# EAGLE design Graduation_Project (EAGLE 9.6.2)
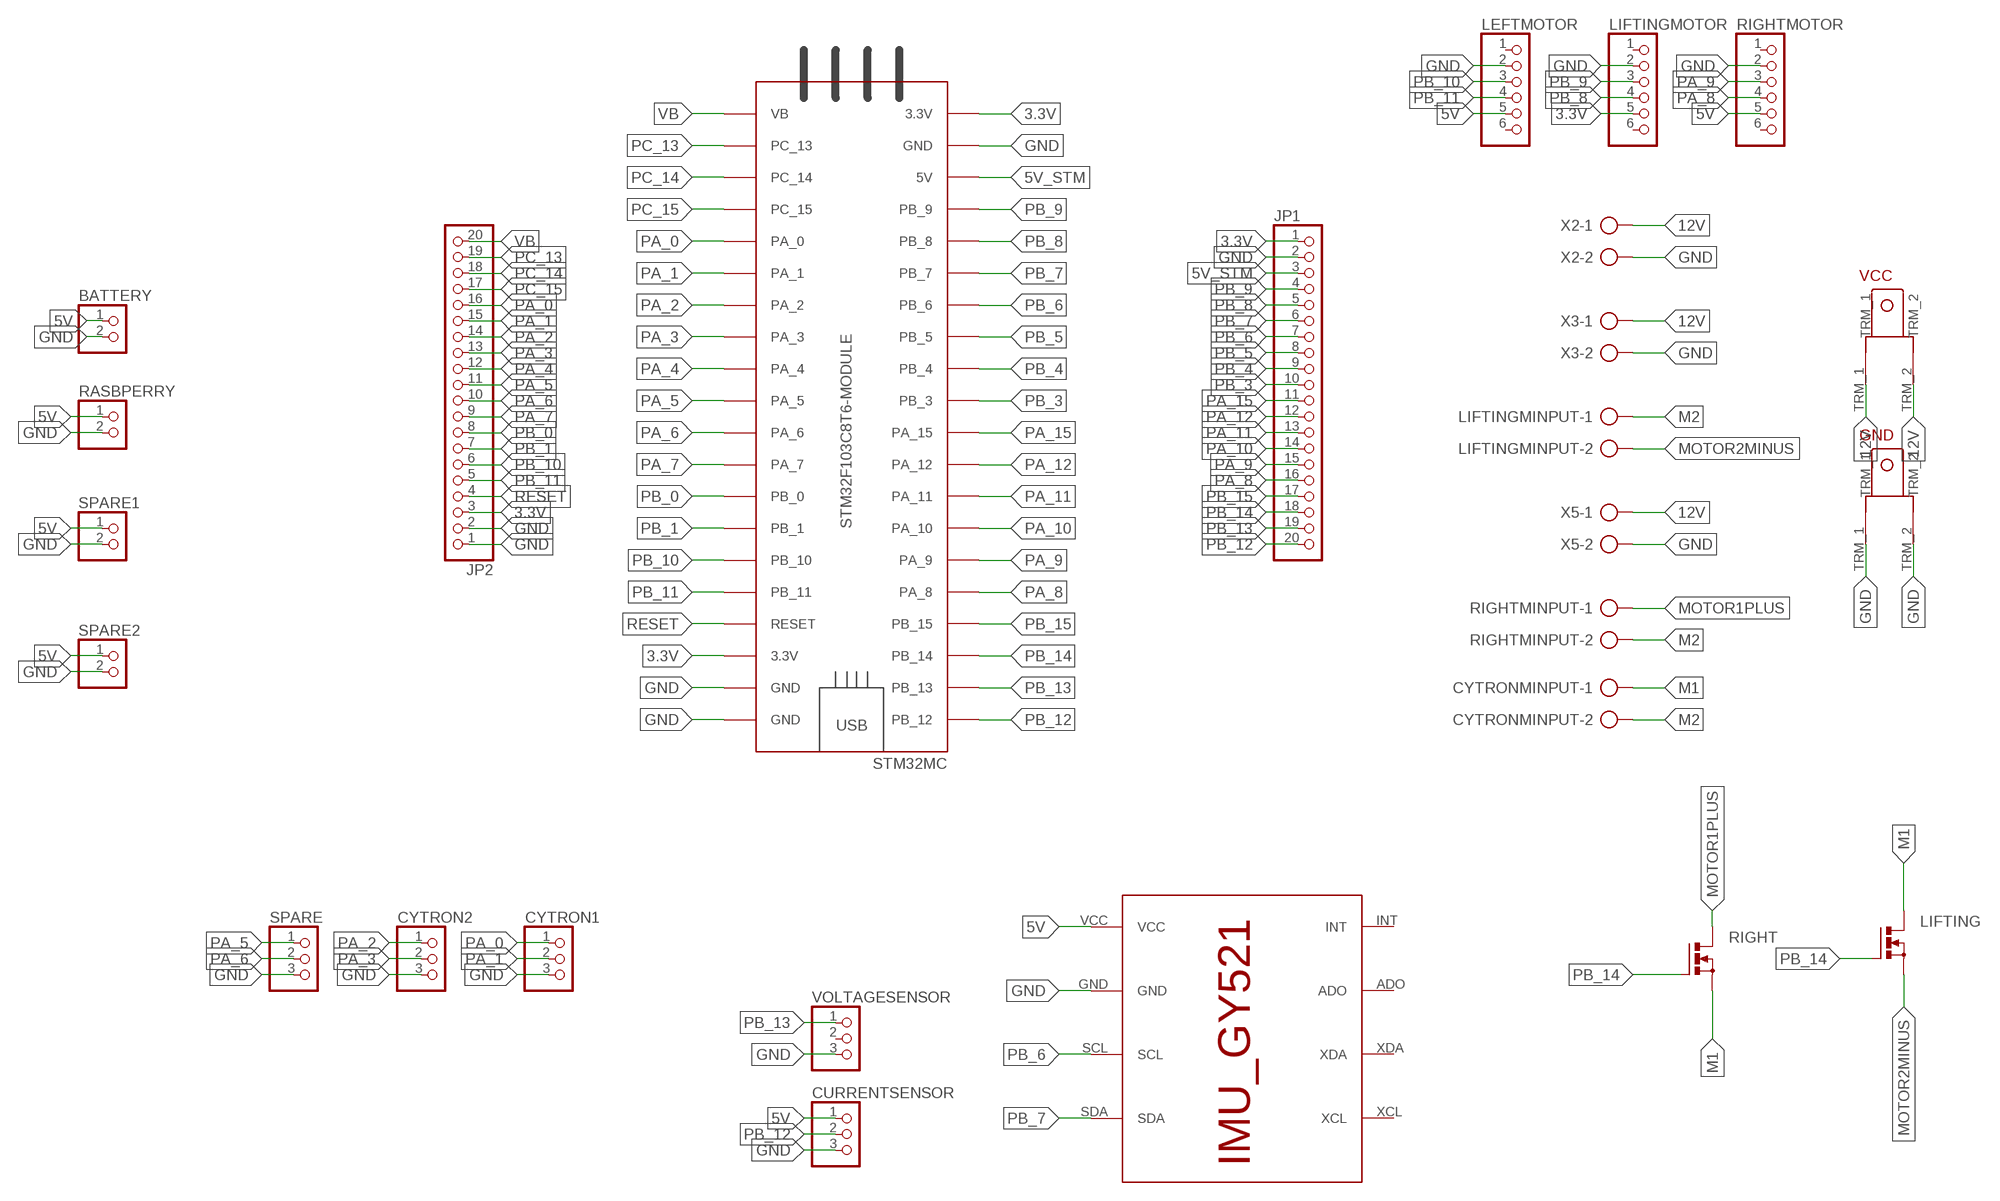
[diagram p0: schematic, sheet 1]

## Parts
BATTERY  PINHD-1X2  [1X02]
CURRENTSENSOR  PINHD-1X3  [1X03]
CYTRON1  PINHD-1X3  [1X03]
CYTRON2  PINHD-1X3  [1X03]
CYTRONMINPUT  AK300/2  [AK300/2]
GND  TERMINAL_EDITED  [TERMINAL_EDITED]
JP1  PINHD-1X20  [1X20]
JP2  PINHD-1X20  [1X20]
LEFTMOTOR  PINHD-1X6  [1X06]
LIFTING  MOSFET_NTO220BH  [TO220BH]
LIFTINGMINPUT  AK300/2  [AK300/2]
LIFTINGMOTOR  PINHD-1X6  [1X06]
RASBPERRY  PINHD-1X2  [1X02]
RIGHT  MOSFET_NTO220BH  [TO220BH]
RIGHTMINPUT  AK300/2  [AK300/2]
RIGHTMOTOR  PINHD-1X6  [1X06]
SPARE  PINHD-1X3  [1X03]
SPARE1  PINHD-1X2  [1X02]
SPARE2  PINHD-1X2  [1X02]
STM32MC  STM32F103C8T6-MODULE  [STM32F103C8T6-MODULE]
U$1  IMU_ROBOCON_GY521  [IMU_GY521]
VCC  TERMINAL_EDITED  [TERMINAL_EDITED]
VOLTAGESENSOR  PINHD-1X3  [1X03]
X2  AK300/2  [AK300/2]
X3  AK300/2  [AK300/2]
X5  AK300/2  [AK300/2]

## Nets
3.3V: JP1.1 JP2.3 LIFTINGMOTOR.5 STM32MC.3.3V_1(3.3V) STM32MC.3.3V_2(3.3V)
5V: BATTERY.1 CURRENTSENSOR.1 LEFTMOTOR.5 RASBPERRY.1 RIGHTMOTOR.5 SPARE1.1 SPARE2.1 U$1.VCC
5V_STM: JP1.3 STM32MC.5V
12V: VCC.TRM_1 VCC.TRM_2 X2.1 X3.1 X5.1
GND: BATTERY.2 CURRENTSENSOR.3 CYTRON1.3 CYTRON2.3 GND.TRM_1 GND.TRM_2 JP1.2 JP2.1 JP2.2 LEFTMOTOR.2 LIFTINGMOTOR.2 RASBPERRY.2 RIGHTMOTOR.2 SPARE1.2 SPARE2.2 SPARE.3 STM32MC.GND_1(GND) STM32MC.GND_2(GND) STM32MC.GND_3(GND) U$1.GND VOLTAGESENSOR.3 X2.2 X3.2 X5.2
M1: CYTRONMINPUT.1 LIFTING.D RIGHT.S
M2: CYTRONMINPUT.2 LIFTINGMINPUT.1 RIGHTMINPUT.2
MOTOR1PLUS: RIGHT.D RIGHTMINPUT.1
MOTOR2MINUS: LIFTING.S LIFTINGMINPUT.2
PA_0: CYTRON1.1 JP2.16 STM32MC.PA_0
PA_1: CYTRON1.2 JP2.15 STM32MC.PA_1
PA_2: CYTRON2.1 JP2.14 STM32MC.PA_2
PA_3: CYTRON2.2 JP2.13 STM32MC.PA_3
PA_4: JP2.12 STM32MC.PA_4
PA_5: JP2.11 SPARE.1 STM32MC.PA_5
PA_6: JP2.10 SPARE.2 STM32MC.PA_6
PA_7: JP2.9 STM32MC.PA_7
PA_8: JP1.16 RIGHTMOTOR.4 STM32MC.PA_8
PA_9: JP1.15 RIGHTMOTOR.3 STM32MC.PA_9
PA_10: JP1.14 STM32MC.PA_10
PA_11: JP1.13 STM32MC.PA_11
PA_12: JP1.12 STM32MC.PA_12
PA_15: JP1.11 STM32MC.PA_15
PB_0: JP2.8 STM32MC.PB_0
PB_1: JP2.7 STM32MC.PB_1
PB_3: JP1.10 STM32MC.PB_3
PB_4: JP1.9 STM32MC.PB_4
PB_5: JP1.8 STM32MC.PB_5
PB_6: JP1.7 STM32MC.PB_6 U$1.SCL
PB_7: JP1.6 STM32MC.PB_7 U$1.SDA
PB_8: JP1.5 LIFTINGMOTOR.4 STM32MC.PB_8
PB_9: JP1.4 LIFTINGMOTOR.3 STM32MC.PB_9
PB_10: JP2.6 LEFTMOTOR.3 STM32MC.PB_10
PB_11: JP2.5 LEFTMOTOR.4 STM32MC.PB_11
PB_12: CURRENTSENSOR.2 JP1.20 STM32MC.PB_12
PB_13: JP1.19 STM32MC.PB_13 VOLTAGESENSOR.1
PB_14: JP1.18 LIFTING.G RIGHT.G STM32MC.PB_14
PB_15: JP1.17 STM32MC.PB_15
PC_13: JP2.19 STM32MC.PC_13
PC_14: JP2.18 STM32MC.PC_14
PC_15: JP2.17 STM32MC.PC_15
RESET: JP2.4 STM32MC.RESET
VB: JP2.20 STM32MC.VB
Unconnected: LEFTMOTOR.1 LEFTMOTOR.6 LIFTINGMOTOR.1 LIFTINGMOTOR.6 RIGHTMOTOR.1 RIGHTMOTOR.6 U$1.ADO U$1.INT U$1.XCL U$1.XDA VOLTAGESENSOR.2

## Library data of the parts
BATTERY RASBPERRY SPARE1 SPARE2 = MIA-Training:PINHD-1X2: PIN HEADER
CURRENTSENSOR CYTRON1 CYTRON2 SPARE VOLTAGESENSOR = MIA-Training:PINHD-1X3: PIN HEADER
CYTRONMINPUT LIFTINGMINPUT RIGHTMINPUT X2 X3 X5 = con-ptr500:AK300/2: CONNECTOR; OC_FARNELL: unknown; OC_NEWARK: unknown
GND VCC = MIA_LIBRARY-2-2-2:TERMINAL_EDITED
JP1 JP2 = MIA_LIBRARY-2-2-2:PINHD-1X20: PIN HEADER
LEFTMOTOR LIFTINGMOTOR RIGHTMOTOR = MIA_LIBRARY-2-2-2:PINHD-1X6: PIN HEADER
LIFTING RIGHT = MIA_LIBRARY-2-2-2:MOSFET_N: Power MOSFET N-Channel
STM32MC = MIA_LIBRARY-2-2-2:STM32F103C8T6-MODULE: STM32F103C8T6 module with ARM Cortex-3, 20kB SRAM, 64kB Flash, 72MHz
U$1 = MIA_LIBRARY-2-2-2:IMU_ROBOCON_GY521

## Board
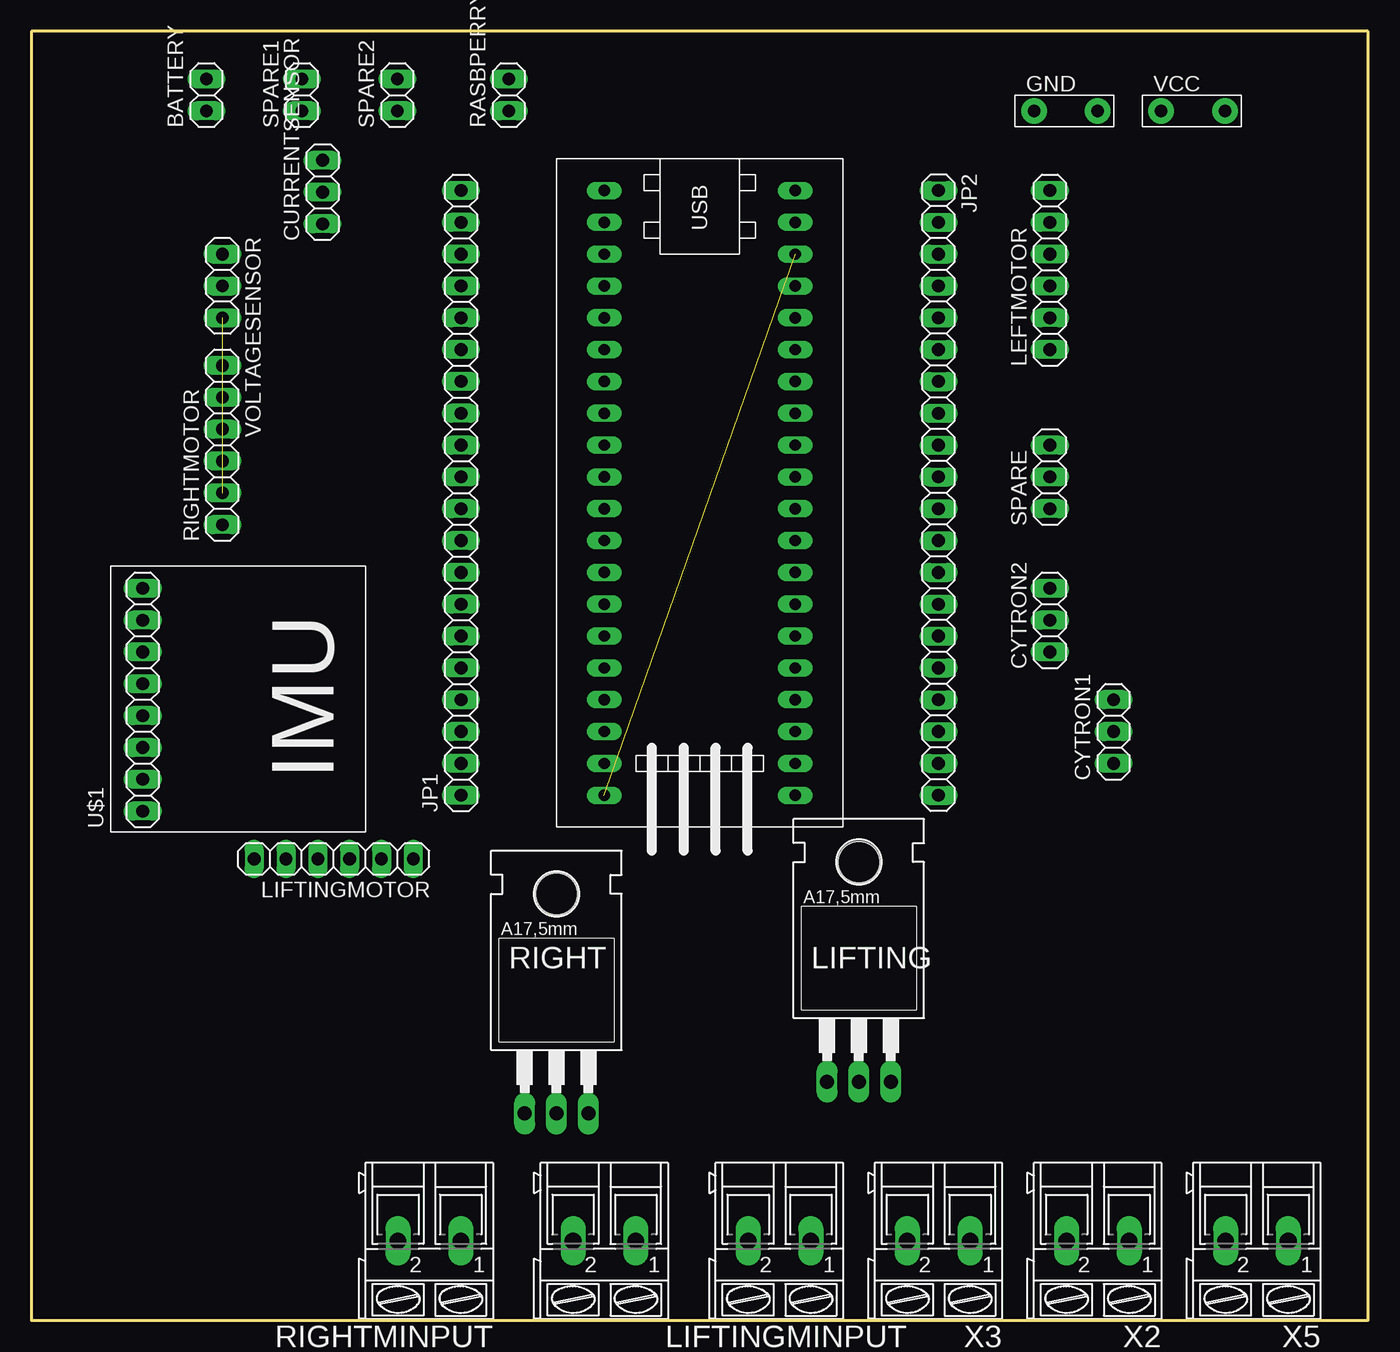
[diagram p1: board, top side]
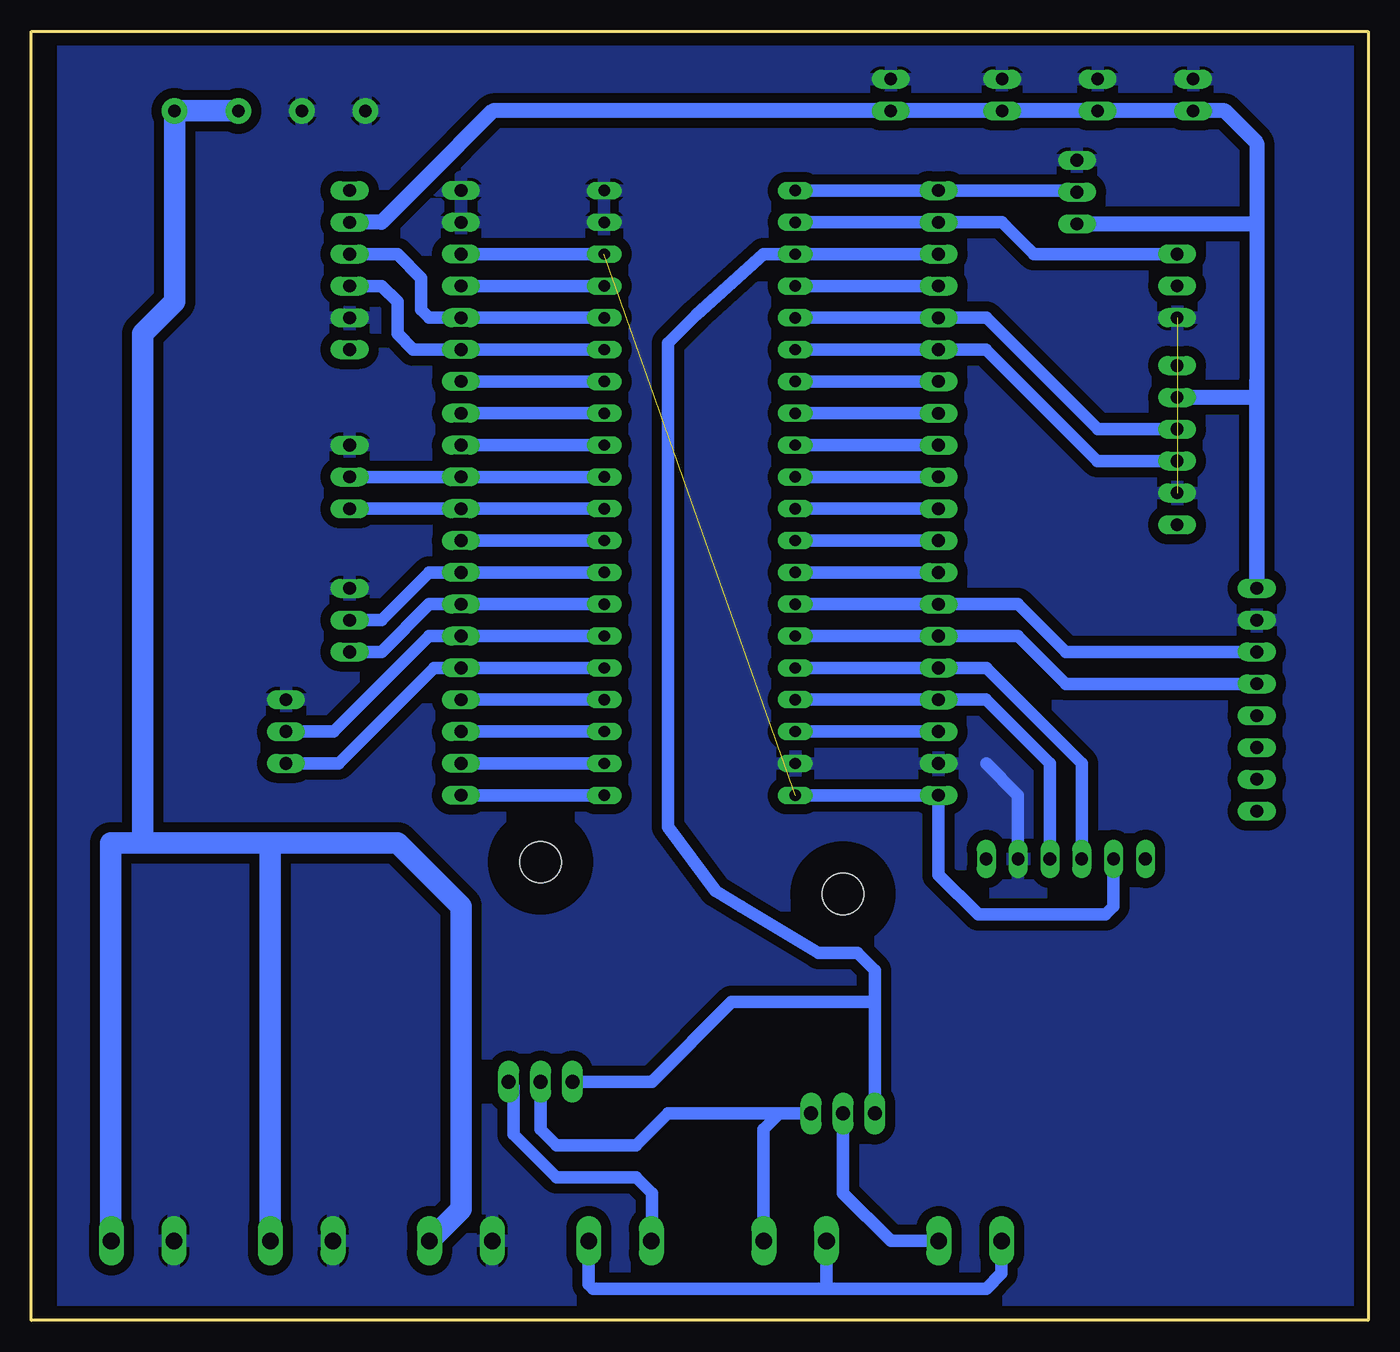
[diagram p2: board, bottom side, seen from below]

Size 106.68 x 102.87 mm. Coordinates in mm from the lower left corner, seen from the top.
Outline: 0,0 106.68,0 106.68,102.87 0,102.87 0,0
Copper layers (1*16): Top 0.035mm / dielectric 1.5mm / Bottom 0.035mm
Design rules "default *": minimum track width 0.8mm, minimum drill 0.35mm, track to track 0.8mm, track to pad 0.8mm, pad to pad 0.8mm, via to via 0.8mm, smd to smd 0.8mm, copper to edge 40mil, drill to drill 6mil, minimum pad ring 10mil, minimum via ring 8mil, stop-mask expansion 4mil, vias tented up to drill 0mil, thermal gap 10mil

### Footprints (pad centres in the part's own frame; a part is rotated, then mirrored left to right if it is on the bottom)
1X02 = drill 1.016 long: 1 -1.27,0; 2 1.27,0
1X03 = drill 1.016 long: 1 -2.54,0; 2 0,0; 3 2.54,0
AK300/2 = drill 1.321 long: 1 -2.515,0; 2 2.489,0
TERMINAL_EDITED = drill 1 pad 2.032: TRM_1 -2.54,0; TRM_2 2.54,0
1X20 = drill 1.016 long: 1 -24.13,0; 2 -21.59,0; 3 -19.05,0; 4 -16.51,0; 5 -13.97,0; 6 -11.43,0; 7 -8.89,0; 8 -6.35,0; 9 -3.81,0; 10 -1.27,0; 11 1.27,0; 12 3.81,0; 13 6.35,0; 14 8.89,0; 15 11.43,0; 16 13.97,0; 17 16.51,0; 18 19.05,0; 19 21.59,0; 20 24.13,0
1X06 = drill 1.016 long: 1 -6.35,0; 2 -3.81,0; 3 -1.27,0; 4 1.27,0; 5 3.81,0; 6 6.35,0
TO220BH = drill 1.118 long: D 0,-6.35; G -2.54,-6.35; S 2.54,-6.35 | hole 3.302: 0,11.176
STM32F103C8T6-MODULE = drill 0.9 long: 3.3V_1 25.4,-7.62; 3.3V_2 -17.78,7.62; 5V 20.32,-7.62; GND_1 22.86,-7.62; GND_2 -20.32,7.62; GND_3 -22.86,7.62; PA_0 15.24,7.62; PA_1 12.7,7.62; PA_2 10.16,7.62; PA_3 7.62,7.62; PA_4 5.08,7.62; PA_5 2.54,7.62; PA_6 0,7.62; PA_7 -2.54,7.62; PA_8 -12.7,-7.62; PA_9 -10.16,-7.62; PA_10 -7.62,-7.62; PA_11 -5.08,-7.62; PA_12 -2.54,-7.62; PA_15 0,-7.62; PB_0 -5.08,7.62; PB_1 -7.62,7.62; PB_3 2.54,-7.62; PB_4 5.08,-7.62; PB_5 7.62,-7.62; PB_6 10.16,-7.62; PB_7 12.7,-7.62; PB_8 15.24,-7.62; PB_9 17.78,-7.62; PB_10 -10.16,7.62; PB_11 -12.7,7.62; PB_12 -22.86,-7.62; PB_13 -20.32,-7.62; PB_14 -17.78,-7.62; PB_15 -15.24,-7.62; PC_13 22.86,7.62; PC_14 20.32,7.62; PC_15 17.78,7.62; RESET -15.24,7.62; VB 25.4,7.62
IMU_GY521 = drill 1.016 long: ADO -6.35,0; GND 6.35,0; INT -8.89,0; SCL 3.81,0; SDA 1.27,0; VCC 8.89,0; XCL -3.81,0; XDA -1.27,0

### Placement (x,y rotation side)
BATTERY  13.97,97.79 90 top
CURRENTSENSOR  23.24,90.04 90 top
CYTRON1  86.36,46.99 90 top
CYTRON2  81.28,55.88 90 top
CYTRONMINPUT  45.72,6.35 180 top
GND  82.55,96.52 0 top
JP1  34.29,66.04 90 top
JP2  72.39,66.04 270 top
LEFTMOTOR  81.28,83.82 90 top
LIFTING  66.04,25.4 0 top
LIFTINGMINPUT  59.69,6.35 180 top
LIFTINGMOTOR  24.13,36.83 180 top
RASBPERRY  38.1,97.79 90 top
RIGHT  41.91,22.86 0 top
RIGHTMINPUT  31.75,6.35 180 top
RIGHTMOTOR  15.24,69.85 90 top
SPARE  81.28,67.31 90 top
SPARE1  21.59,97.79 90 top
SPARE2  29.21,97.79 90 top
STM32MC  53.34,67.31 270 top
U$1  8.89,49.53 90 top
VCC  92.71,96.52 0 top
VOLTAGESENSOR  15.24,82.55 270 top
X2  85.09,6.35 180 top
X3  72.39,6.35 180 top
X5  97.79,6.35 180 top

### Tracks (layer width: path | path; a pad name or v marks a point on that pad's centre or on a via)
3.3V  (1 unrouted)
  Bottom 1: STM32MC.3.3V_1 JP1.1 34.29,35.56 31.11,32.38 20.95,32.38 20.32,33.02 LIFTINGMOTOR.5 | JP2.3 STM32MC.3.3V_2
5V
  Bottom 1.2: LEFTMOTOR.5 78.74,87.63 75.31,91.06 75.31,91.07 69.86,96.52 RASBPERRY.1 SPARE2.1 SPARE1.1 BATTERY.1 11.43,96.52 8.89,93.98 8.89,87.63 | 8.89,87.63 8.89,74.93 8.89,73.66 RIGHTMOTOR.5 | CURRENTSENSOR.1 9.02,87.5 8.89,87.63
  Bottom 1.22: U$1.VCC 8.89,74.93
5V_STM
  Bottom 1: JP1.3 STM32MC.5V
12V
  Bottom 1.7: 97.79,38.1 97.79,78.74 95.25,81.28 VCC.TRM_2 VCC.TRM_1 | X3.1 72.39,8.87 72.39,33.02 77.47,38.1 87.63,38.1 | 87.63,38.1 97.79,38.1 | 97.79,38.1 100.33,38.1 100.33,6.35 X5.1 | 87.63,38.1 87.61,38.08 X2.1
GND  (1 unrouted)
  Bottom 1: LIFTINGMOTOR.2 27.94,41.91 30.48,44.45
  pour Bottom: 1.27,101.6 104.14,101.6 104.14,1.27 1.27,1.27
M1
  Bottom 1: CYTRONMINPUT.1 48.26,6.38 48.26,15.24 46.99,16.51 RIGHT.S 55.88,16.51 58.42,13.97 64.77,13.97 66.04,15.24 LIFTING.D
M2
  Bottom 1: RIGHTMINPUT.2 29.26,3.76 30.48,2.54 43.23,2.54 | 43.23,2.54 CYTRONMINPUT.2 | LIFTINGMINPUT.1 62.2,2.89 61.86,2.54 43.23,2.54
MOTOR1PLUS
  Bottom 1: RIGHT.D 41.91,10.16 38.1,6.35 RIGHTMINPUT.1
MOTOR2MINUS
  Bottom 1: LIFTING.S 68.18,18.65 68.18,14.83 64.78,11.43 58.42,11.43 57.15,10.16 57.15,6.35 LIFTINGMINPUT.2
PA_0
  Bottom 1: STM32MC.PA_0 JP2.16 74.55,52.07 82.17,44.45 CYTRON1.1
PA_1
  Bottom 1: STM32MC.PA_1 JP2.15 74.92,54.61 82.54,46.99 CYTRON1.2
PA_2
  Bottom 1: STM32MC.PA_2 JP2.14 74.92,57.15 78.73,53.34 CYTRON2.1
PA_3
  Bottom 1: STM32MC.PA_3 JP2.13 74.93,59.69 78.74,55.88 CYTRON2.2
PA_4
  Bottom 1: JP2.12 STM32MC.PA_4
PA_5
  Bottom 1: STM32MC.PA_5 JP2.11 SPARE.1
PA_6
  Bottom 1: STM32MC.PA_6 JP2.10 SPARE.2
PA_7
  Bottom 1: JP2.9 STM32MC.PA_7
PA_8
  Bottom 1: RIGHTMOTOR.4 21.59,71.12 30.48,80.01 JP1.16 STM32MC.PA_8
PA_9
  Bottom 1: RIGHTMOTOR.3 21.6,68.58 30.49,77.47 JP1.15 STM32MC.PA_9
PA_10
  Bottom 1: JP1.14 STM32MC.PA_10
PA_11
  Bottom 1: JP1.13 STM32MC.PA_11
PA_12
  Bottom 1: JP1.12 STM32MC.PA_12
PA_15
  Bottom 1: JP1.11 STM32MC.PA_15
PB_0
  Bottom 1: JP2.8 STM32MC.PB_0
PB_1
  Bottom 1: JP2.7 STM32MC.PB_1
PB_3
  Bottom 1: JP1.10 STM32MC.PB_3
PB_4
  Bottom 1: JP1.9 STM32MC.PB_4
PB_5
  Bottom 1: JP1.8 STM32MC.PB_5
PB_6
  Bottom 1: STM32MC.PB_6 JP1.7 27.94,57.15 24.13,53.34 U$1.SCL
PB_7
  Bottom 1: STM32MC.PB_7 JP1.6 27.95,54.61 24.14,50.8 U$1.SDA
PB_8
  Bottom 1: STM32MC.PB_8 JP1.5 30.48,52.07 22.86,44.45 LIFTINGMOTOR.4
PB_9
  Bottom 1: STM32MC.PB_9 JP1.4 30.49,49.53 25.4,44.44 LIFTINGMOTOR.3
PB_10
  Bottom 1: STM32MC.PB_10 JP2.6 76.2,77.47 77.47,78.74 77.47,81.28 78.74,82.55 LEFTMOTOR.3
PB_11
  Bottom 1: STM32MC.PB_11 JP2.5 74.93,80.01 75.56,80.65 75.56,83.19 77.47,85.09 LEFTMOTOR.4
PB_12
  Bottom 1: STM32MC.PB_12 JP1.20 23.37,90.17 CURRENTSENSOR.2
PB_13
  Bottom 1: VOLTAGESENSOR.1 26.67,85.09 29.21,87.63 JP1.19 STM32MC.PB_13
PB_14
  Bottom 1: JP1.18 STM32MC.PB_14 48.26,85.09 53.59,80.26 55.88,77.98 55.88,39.37 52.07,34.29 50.07,33.02 43.85,29.34 40.77,29.34 39.37,27.94 39.37,25.4 | RIGHT.G 39.37,25.4 | 39.37,25.4 50.8,25.4 57.15,19.05 LIFTING.G
PB_15
  Bottom 1: JP1.17 STM32MC.PB_15
PC_13
  Bottom 1: JP2.19 STM32MC.PC_13
PC_14
  Bottom 1: JP2.18 STM32MC.PC_14
PC_15
  Bottom 1: JP2.17 STM32MC.PC_15
RESET
  Bottom 1: JP2.4 STM32MC.RESET
VB
  Bottom 1: JP2.20 STM32MC.VB